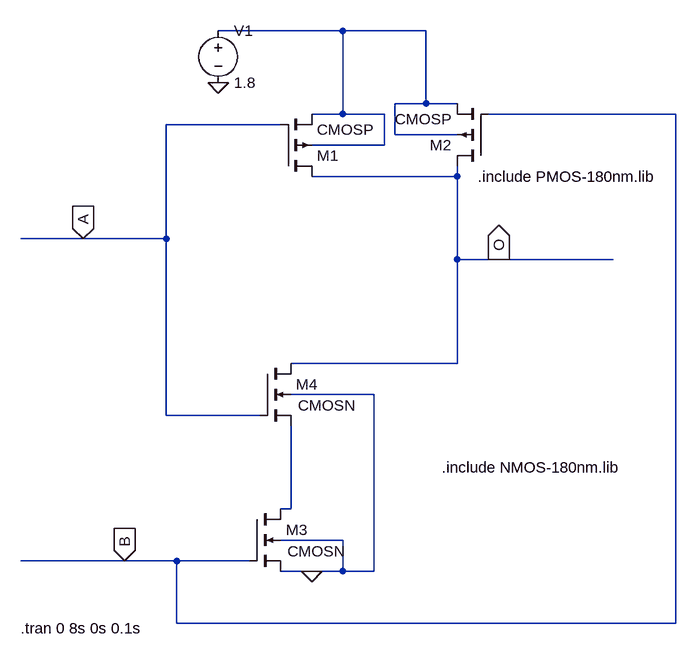
[diagram p0: schematic NAND.asc]
NAND.asc, the LTspice schematic file:
Version 4
SHEET 1 1120 680
WIRE 256 -400 64 -400
WIRE 384 -400 256 -400
WIRE 384 -288 384 -400
WIRE 384 -288 336 -288
WIRE 432 -288 384 -288
WIRE 256 -272 256 -400
WIRE 256 -272 208 -272
WIRE 320 -272 256 -272
WIRE 768 -272 480 -272
WIRE 160 -256 -16 -256
WIRE 336 -240 336 -288
WIRE 432 -240 336 -240
WIRE 320 -224 320 -272
WIRE 320 -224 208 -224
WIRE 432 -176 432 -192
WIRE 432 -176 208 -176
WIRE -144 -80 -240 -80
WIRE -16 -80 -16 -256
WIRE -16 -80 -144 -80
WIRE 432 -48 432 -176
WIRE 496 -48 432 -48
WIRE 672 -48 496 -48
WIRE 432 112 432 -48
WIRE 432 112 176 112
WIRE 304 160 176 160
WIRE -16 192 -16 -80
WIRE 128 192 -16 192
WIRE 176 336 176 208
WIRE 176 336 160 336
WIRE 256 384 160 384
WIRE -80 416 -240 416
WIRE 0 416 -80 416
WIRE 112 416 0 416
WIRE 208 432 160 432
WIRE 256 432 256 384
WIRE 256 432 208 432
WIRE 304 432 304 160
WIRE 304 432 256 432
WIRE 0 512 0 416
WIRE 768 512 768 -272
WIRE 768 512 0 512
FLAG 208 432 0
FLAG 64 -320 0
FLAG 496 -48 O
IOPIN 496 -48 Out
FLAG -144 -80 A
IOPIN -144 -80 In
FLAG -80 416 B
IOPIN -80 416 In
SYMBOL voltage 64 -416 R0
WINDOW 123 0 0 Left 0
WINDOW 39 0 0 Left 0
SYMATTR InstName V1
SYMATTR Value 1.8
SYMBOL pmos4 160 -176 M180
SYMATTR InstName M1
SYMATTR Value CMOSP
SYMATTR Value2 l=180n w=900n m=1
SYMBOL pmos4 480 -192 R180
SYMATTR InstName M2
SYMATTR Value CMOSP
SYMATTR Value2 l=180n w=900n m=1
SYMBOL nmos4 112 336 R0
WINDOW 3 59 65 Left 2
SYMATTR Value CMOSN
SYMATTR InstName M3
SYMATTR Value2 l=180n w=360n
SYMBOL nmos4 128 112 R0
WINDOW 3 59 65 Left 2
SYMATTR Value CMOSN
SYMATTR InstName M4
SYMATTR Value2 l=180n w=360n
TEXT 408 272 Left 2 !.include NMOS-180nm.lib
TEXT -240 520 Left 2 !.tran 0 8s 0s 0.1s
TEXT 464 -176 Left 2 !.include PMOS-180nm.lib

The netlist it stands for:
* NAND.asc
V1 N001 0 1.8
M1 O A N001 N001 CMOSP l=180n w=900n m=1
M2 O B N001 N001 CMOSP l=180n w=900n m=1
M3 N002 B 0 0 CMOSN l=180n w=360n
M4 O A N002 0 CMOSN l=180n w=360n
.model NMOS NMOS
.model PMOS PMOS
.lib standard.mos
.include NMOS-180nm.lib
.tran 0 8s 0s 0.1s
.include PMOS-180nm.lib
.backanno
.end